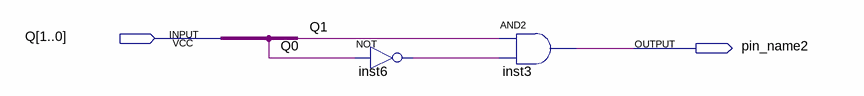
[diagram p0: schematic sheet]
// Quartus schematic DECODE.bdf as structural Verilog: 2 symbols, 2 pins
module DECODE (
  input  [1:0] Q,
  output pin_name2
);

  wire inst6_out;

  not inst6 (inst6_out, Q[0]);
  and inst3 (pin_name2, Q[1], inst6_out);
endmodule
